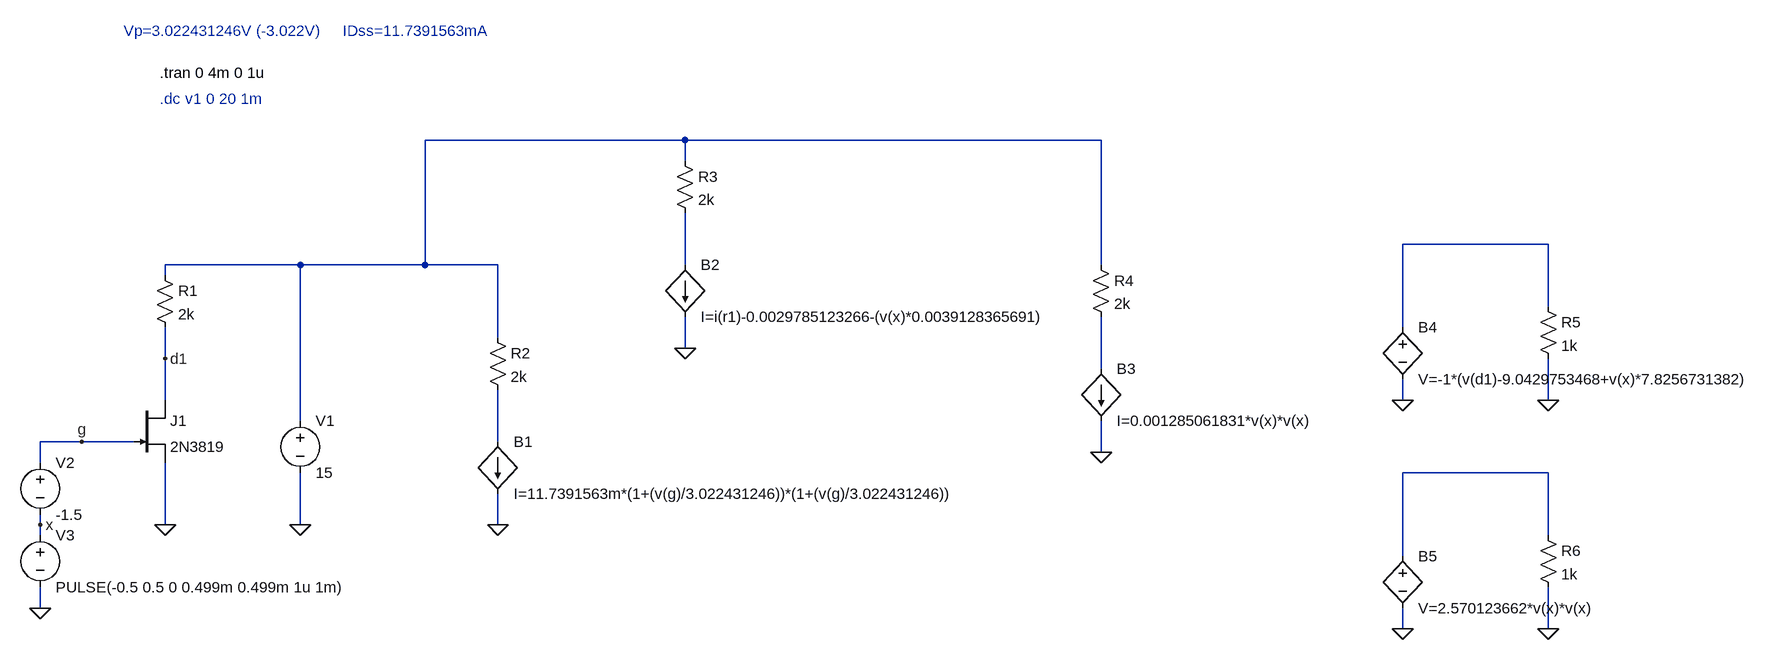
[diagram p0: schematic jfet_transf3.asc]
jfet_transf3.asc, the LTspice schematic file:
Version 4
SHEET 1 2756 740
WIRE 1040 -256 640 -256
WIRE 1680 -256 1040 -256
WIRE 1040 -224 1040 -256
WIRE 2368 -96 2144 -96
WIRE 448 -64 240 -64
WIRE 640 -64 640 -256
WIRE 640 -64 448 -64
WIRE 752 -64 640 -64
WIRE 1040 -64 1040 -144
WIRE 1680 -64 1680 -256
WIRE 240 -48 240 -64
WIRE 2368 0 2368 -96
WIRE 2144 32 2144 -96
WIRE 752 48 752 -64
WIRE 1040 64 1040 16
WIRE 240 80 240 32
WIRE 1680 96 1680 16
WIRE 240 144 240 80
WIRE 2144 144 2144 112
WIRE 2368 144 2368 80
WIRE 448 176 448 -64
WIRE 112 208 48 208
WIRE 192 208 112 208
WIRE 752 208 752 128
WIRE 1680 224 1680 176
WIRE 48 240 48 208
WIRE 2368 256 2144 256
WIRE 48 336 48 320
WIRE 240 336 240 240
WIRE 448 336 448 256
WIRE 752 336 752 288
WIRE 48 352 48 336
WIRE 2368 352 2368 256
WIRE 2144 384 2144 256
WIRE 48 464 48 432
WIRE 2144 496 2144 464
WIRE 2368 496 2368 432
FLAG 240 336 0
FLAG 448 336 0
FLAG 48 464 0
FLAG 112 208 g
FLAG 752 336 0
FLAG 48 336 x
FLAG 1040 64 0
FLAG 1680 224 0
FLAG 240 80 d1
FLAG 2144 144 0
FLAG 2368 144 0
FLAG 2144 496 0
FLAG 2368 496 0
SYMBOL njf 192 144 R0
SYMATTR InstName J1
SYMATTR Value 2N3819
SYMBOL voltage 448 160 R0
WINDOW 123 0 0 Left 0
WINDOW 39 0 0 Left 0
SYMATTR InstName V1
SYMATTR Value 15
SYMBOL voltage 48 224 R0
WINDOW 123 0 0 Left 0
WINDOW 39 0 0 Left 0
SYMATTR InstName V2
SYMATTR Value -1.5
SYMBOL voltage 48 336 R0
WINDOW 123 0 0 Left 0
WINDOW 39 0 0 Left 0
SYMATTR InstName V3
SYMATTR Value PULSE(-0.5 0.5 0 0.499m 0.499m 1u 1m)
SYMBOL res 224 -64 R0
SYMATTR InstName R1
SYMATTR Value 2k
SYMBOL bi 752 208 R0
SYMATTR InstName B1
SYMATTR Value I=11.7391563m*(1+(v(g)/3.022431246))*(1+(v(g)/3.022431246))
SYMBOL res 736 32 R0
SYMATTR InstName R2
SYMATTR Value 2k
SYMBOL bi 1040 -64 R0
SYMATTR InstName B2
SYMATTR Value I=i(r1)-0.0029785123266-(v(x)*0.0039128365691)
SYMBOL res 1024 -240 R0
SYMATTR InstName R3
SYMATTR Value 2k
SYMBOL bi 1680 96 R0
SYMATTR InstName B3
SYMATTR Value I=0.001285061831*v(x)*v(x)
SYMBOL res 1664 -80 R0
SYMATTR InstName R4
SYMATTR Value 2k
SYMBOL bv 2144 16 R0
SYMATTR InstName B4
SYMATTR Value V=-1*(v(d1)-9.0429753468+v(x)*7.8256731382)
SYMBOL res 2352 -16 R0
SYMATTR InstName R5
SYMATTR Value 1k
SYMBOL bv 2144 368 R0
SYMATTR InstName B5
SYMATTR Value V=2.570123662*v(x)*v(x)
SYMBOL res 2352 336 R0
SYMATTR InstName R6
SYMATTR Value 1k
TEXT 176 -424 Left 2 ;Vp=3.022431246V (-3.022V)     IDss=11.7391563mA
TEXT 232 -320 Left 2 ;.dc v1 0 20 1m
TEXT 232 -360 Left 2 !.tran 0 4m 0 1u

The netlist it stands for:
* jfet_transf3.asc
J1 d1 g 0 2N3819
V1 N001 0 15
V2 g x -1.5
V3 x 0 PULSE(-0.5 0.5 0 0.499m 0.499m 1u 1m)
R1 N001 d1 2k
B1 N005 0 I=11.7391563m*(1+(v(g)/3.022431246))*(1+(v(g)/3.022431246))
R2 N001 N005 2k
B2 N003 0 I=i(r1)-0.0029785123266-(v(x)*0.0039128365691)
R3 N001 N003 2k
B3 N004 0 I=0.001285061831*v(x)*v(x)
R4 N001 N004 2k
B4 N002 0 V=-1*(v(d1)-9.0429753468+v(x)*7.8256731382)
R5 N002 0 1k
B5 N006 0 V=2.570123662*v(x)*v(x)
R6 N006 0 1k
.model NJF NJF
.model PJF PJF
.lib standard.jft
* Vp=3.022431246V (-3.022V)     IDss=11.7391563mA
* .dc v1 0 20 1m
.tran 0 4m 0 1u
.backanno
.end